# EAGLE design energy-wristband-v1 (EAGLE 5.12)
DATABASE: ../../partsdb.txt; PARTNO: MCP73831T-2ATI/OT
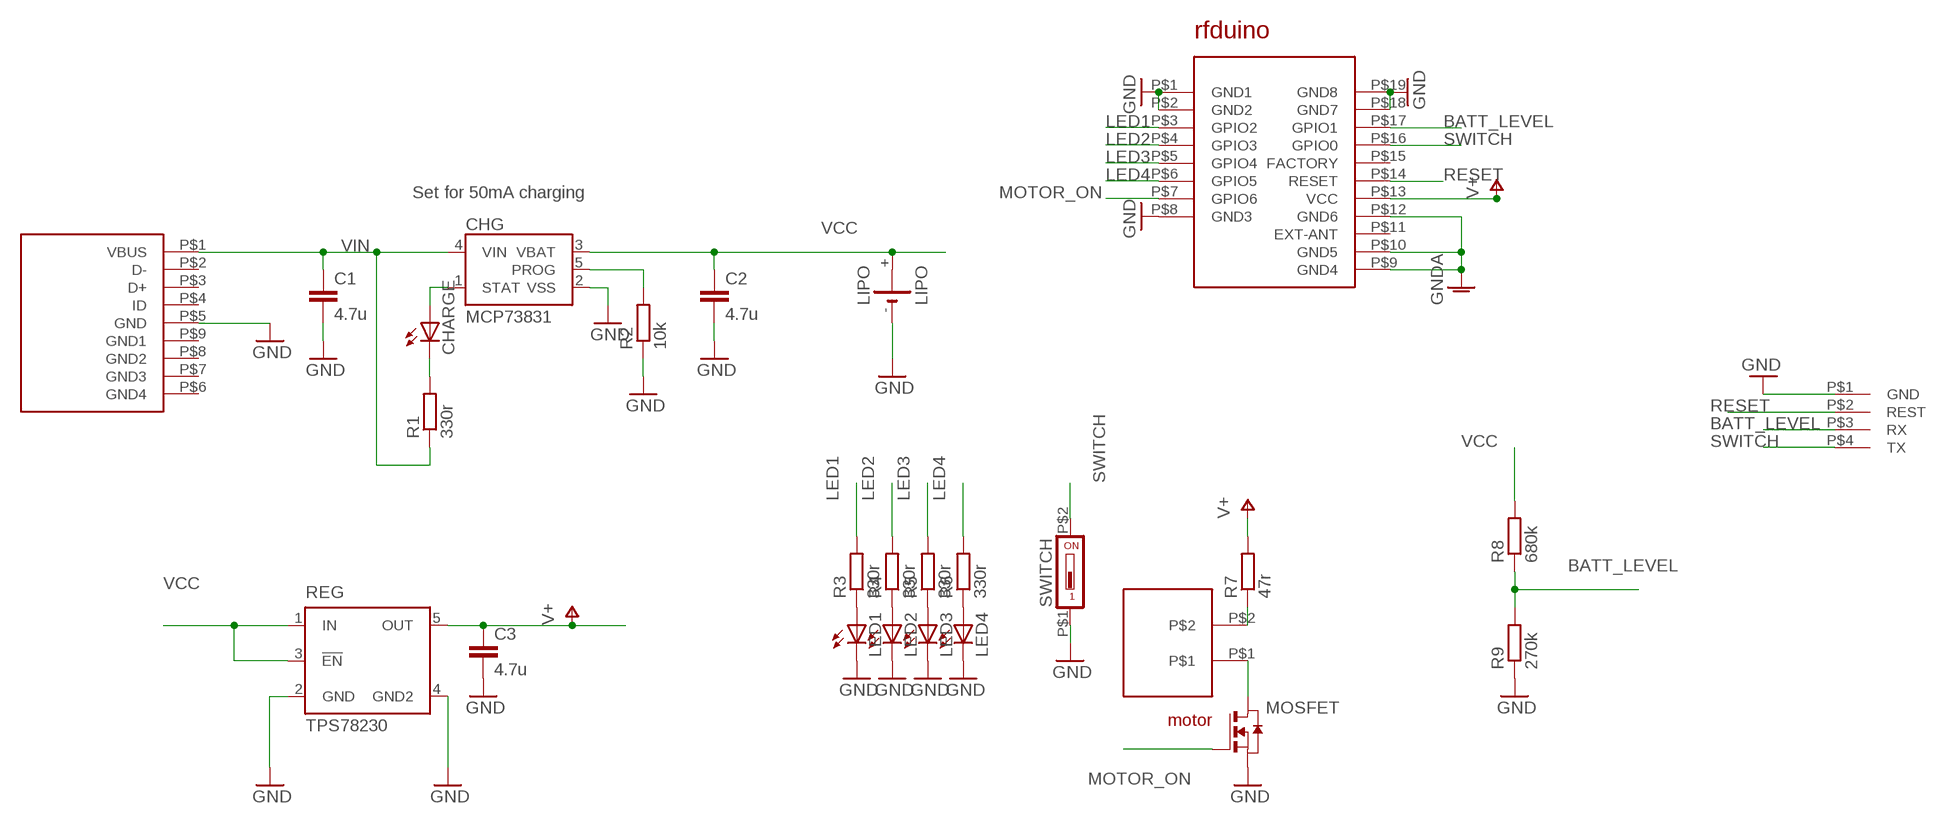
[diagram p0: schematic, sheet 1]

## Parts
C1  4.7u  C-EUC1206  [C1206]
C2  4.7u  C-EUC1206  [C1206]
C3  4.7u  C-EUC1206  [C1206]
CHARGE  LEDSMT1206  [1206]
CHG  MCP73831  [SOT23-5]
LED1  LEDSMT1206  [1206]
LED2  LEDSMT1206  [1206]
LED3  LEDSMT1206  [1206]
LED4  LEDSMT1206  [1206]
LIPO  LIPO  [LIPO]
M1  PAGERMOTOR  [PAGERMOTOR]
MOSFET  NMOSSOT23  [SOT-23]
PRG  PROG-MINI  [PROG-MINI]
R1  330r  R-EU_R1206  [R1206]
R2  10k  R-EU_R1206  [R1206]
R3  330r  R-EU_R1206  [R1206]
R4  330r  R-EU_R1206  [R1206]
R5  330r  R-EU_R1206  [R1206]
R6  330r  R-EU_R1206  [R1206]
R7  47r  R-EU_R1206  [R1206]
R8  680k  R-EU_R1206  [R1206]
R9  270k  R-EU_R1206  [R1206]
REG  TPS78230  [SOT23-DBV]
RFDUINO  RFDUINO  [RFDUINO]
SWITCH  EVPAW  [SD4-01]
USB  USB-MICRO  [USB-MICRO]

## Nets
BATT_LEVEL: PRG.P$3(RX) R8.1 R9.2 RFDUINO.P$17(GPIO1)
GND: C1.2 C2.2 C3.2 CHG.2(VSS) LED1.C LED2.C LED3.C LED4.C LIPO.- MOSFET.2(S) PRG.P$1(GND) R2.1 R9.1 REG.2(GND) REG.4(GND2) RFDUINO.P$1(GND1) RFDUINO.P$2(GND2) RFDUINO.P$8(GND3) RFDUINO.P$18(GND7) RFDUINO.P$19(GND8) SWITCH.P$1 USB.P$5(GND)
GNDA: RFDUINO.P$9(GND4) RFDUINO.P$10(GND5) RFDUINO.P$12(GND6)
LED1: R3.2 RFDUINO.P$3(GPIO2)
LED2: R4.2 RFDUINO.P$4(GPIO3)
LED3: R5.2 RFDUINO.P$5(GPIO4)
LED4: R6.2 RFDUINO.P$6(GPIO5)
MOTOR_ON: MOSFET.1(G) RFDUINO.P$7(GPIO6)
N$1: M1.P$2 R7.1
N$2: LED1.A R3.1
N$3: CHARGE.C R1.2
N$4: LED3.A R5.1
N$5: LED4.A R6.1
N$6: LED2.A R4.1
N$7: M1.P$1 MOSFET.3(D)
PROG: CHG.5(PROG) R2.2
RESET: PRG.P$2(REST) RFDUINO.P$14(RESET)
STAT: CHARGE.A CHG.1(STAT)
SWITCH: PRG.P$4(TX) RFDUINO.P$16(GPIO0) SWITCH.P$2
V+: C3.1 R7.2 REG.5(OUT) RFDUINO.P$13(VCC)
VCC: C2.1 CHG.3(VBAT) LIPO.+ R8.2 REG.1(IN) REG.3(!EN)
VIN: C1.1 CHG.4(VIN) R1.1 USB.P$1(VBUS)
Unconnected: RFDUINO.P$11(EXT-ANT) RFDUINO.P$15(FACTORY) USB.P$2(D-) USB.P$3(D+) USB.P$4(ID) USB.P$6(GND4) USB.P$7(GND3) USB.P$8(GND2) USB.P$9(GND1)

## Notes on the sheet
- Set for 50mA charging

## Library data of the parts
C1-C3 = rcl:C-EU: CAPACITOR, European symbol
CHARGE LED1-LED4 = matt led:LED: LED OSRAM: - CHIPLED LG R971, LG N971, LY N971, LG Q971, LY Q971, LO R971, LY R971 LH N974, LH R974 LS Q976, LO Q976, LY Q976 LO Q996 - Hyper CHIPLED LW Q18S LB Q993, LB Q99A, LB R99A - SideLED LS A670, LO A670, LY A670, LG A670, LP A670 LB A673, LV A673, LT A673, LW A673 LH A674 LY A675 LS A676, LA A676, LO A676, LY A676, LW A676 LS A679, LY A679, LG A679 - Hyper Micro SIDELED® LS Y876, LA Y876, LO Y876, LY Y876 LT Y87S - SmartLED LW L88C, LW L88S LB L89C, LB L89S, LG L890 LS L89K, LO L89K, LY L89K LS L896, LA L896, LO L896, LY L896 - TOPLED LS T670, LO T670, LY T670, LG T670, LP T670 LSG T670, LSP T670, LSY T670, LOP T670, LYG T670 LG T671, LOG T671, LSG T671 LB T673, LV T673, LT T673, LW T673 LH T674 LS T676, LA T676, LO T676, LY T676, LB T676, LH T676, LSB T676, LW T676 LB T67C, LV T67C, LT T67C, LS T67K, LO T67K, LY T67K, LW E67C LS E67B, LA E67B, LO E67B, LY E67B, LB E67C, LV E67C, LT E67C LW T67C LS T679, LY T679, LG T679 LS T770, LO T770, LY T770, LG T770, LP T770 LB T773, LV T773, LT T773, LW T773 LH T774 LS E675, LA E675, LY E675, LS T675 LS T776, LA T776, LO T776, LY T776, LB T776 LHGB T686 LT T68C, LB T68C - Hyper Mini TOPLED® LB M676 - Mini TOPLED Santana® LG M470 LS M47K, LO M47K, LY M47K Source: http://www.osram.convergy.de LUXEON: - LUMILED® LXK2-PW12-R00, LXK2-PW12-S00, LXK2-PW14-U00, LXK2-PW14-V00 LXK2-PM12-R00, LXK2-PM12-S00, LXK2-PM14-U00 LXK2-PE12-Q00, LXK2-PE12-R00, LXK2-PE12-S00, LXK2-PE14-T00, LXK2-PE14-U00 LXK2-PB12-K00, LXK2-PB12-L00, LXK2-PB12-M00, LXK2-PB14-N00, LXK2-PB14-P00, LXK2-PB14-Q00 LXK2-PR12-L00, LXK2-PR12-M00, LXK2-PR14-Q00, LXK2-PR14-R00 LXK2-PD12-Q00, LXK2-PD12-R00, LXK2-PD12-S00 LXK2-PH12-R00, LXK2-PH12-S00 LXK2-PL12-P00, LXK2-PL12-Q00, LXK2-PL12-R00 Source: www.luxeon.com KINGBRIGHT: KA-3528ASYC Source: www.kingbright.com
CHG = SparkFun:MCP73831: Microchip's MCP73831 Miniature single cell, fully integrated Li-Ion, Li-polymer charge management controller http://ww1.microchip.com/downloads/en/DeviceDoc/21984a.pdf
LIPO = matt:LIPO: LI BATTERY Sonnenschein
M1 = matt:PAGERMOTOR
MOSFET = matt:NMOSSOT23: MOS FET; OC_FARNELL: unknown; OC_NEWARK: unknown
PRG = matt:PROG-MINI
R1-R9 = rcl:R-EU_: RESISTOR, European symbol
REG = matt:TPS782*: ULTRALOW-POWER 50-mA LOW-DROPOUT LINEAR REGULATORS 50-mA Low-Dropout Regulator Source: http://focus.ti.com/lit/ds/symlink/tps77001.pdf; MF: TEXAS INSTRUMENTS; MPN: TPS77030DBVT; OC_FARNELL: 1207348; OC_NEWARK: 77C1185
RFDUINO = matt:RFDUINO
SWITCH = matt:EVPAW: DIL/CODE SWITCH; OC_FARNELL: unknown; OC_NEWARK: unknown
USB = matt:USB-MICRO

## Net classes
1 power: width 3 mm

## Board
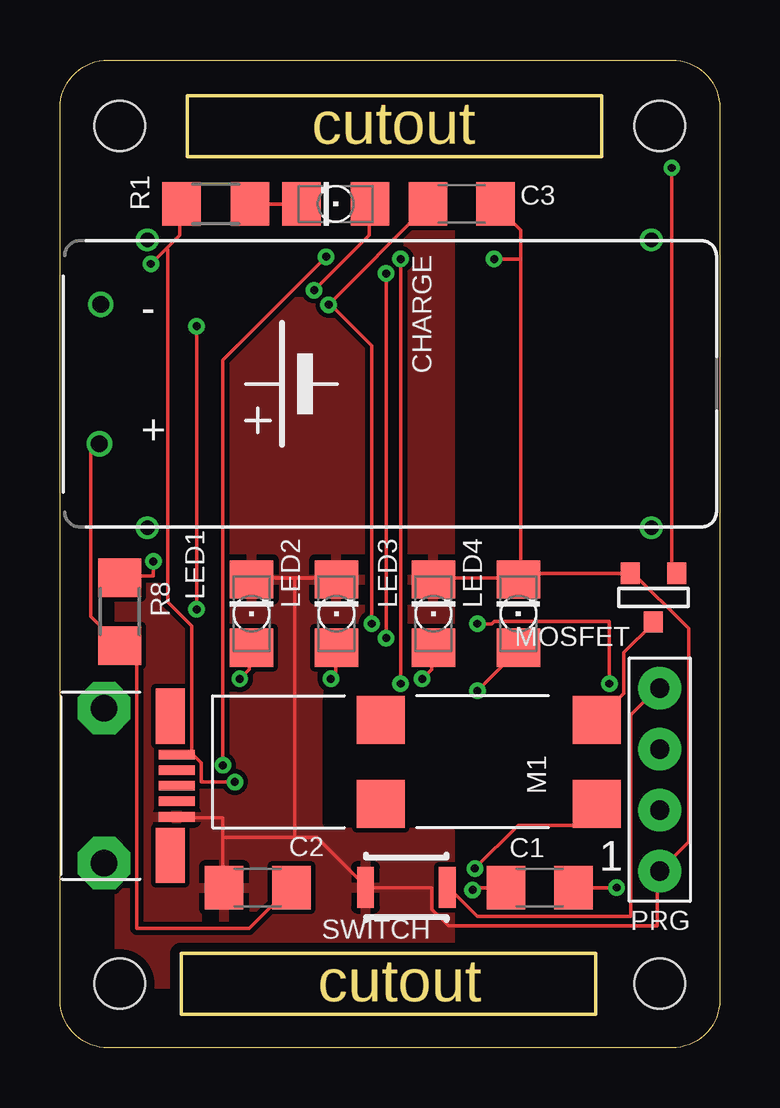
[diagram p1: board, top side]
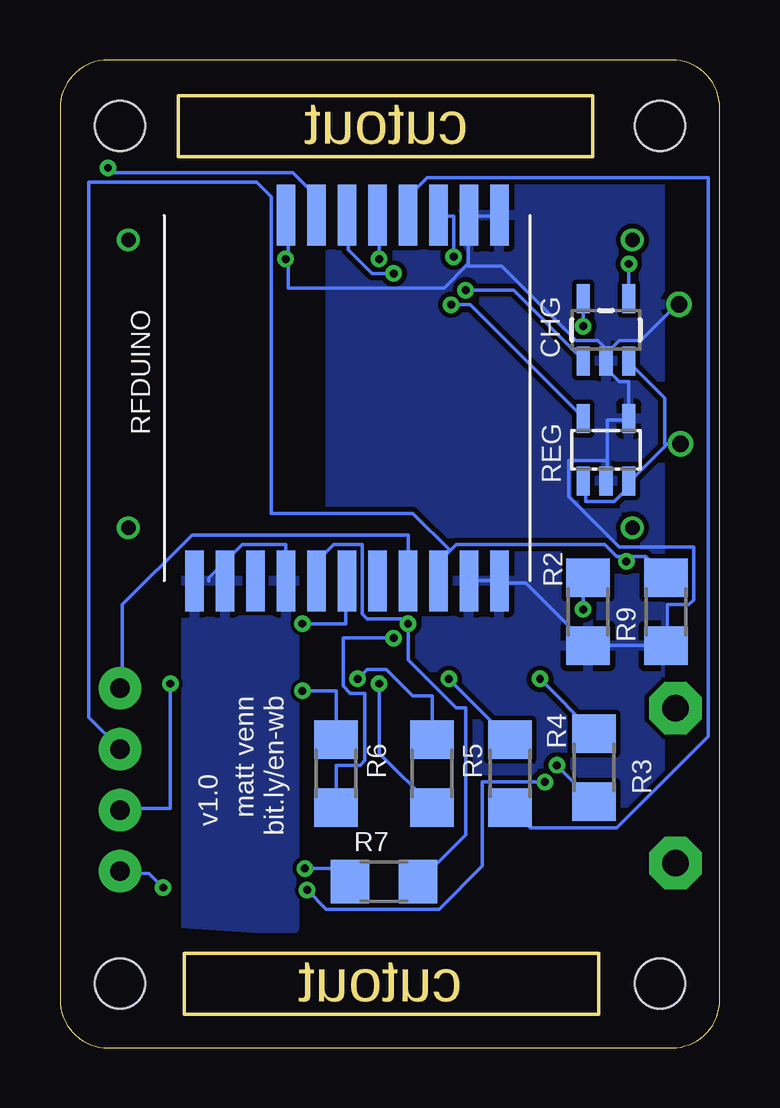
[diagram p2: board, bottom side, seen from below]

Size 27.49 x 41.18 mm. Coordinates in mm from the lower left corner, seen from the top.
Outline: 2,0 arc-90 0,2 0,39.18 arc-90 2,41.18 25.49,41.18 arc-90 27.49,39.18 27.49,2 arc-90 25.49,0 2,0
Outline: 5.05,1.4 5.05,3.94 22.32,3.94 22.32,1.4 5.05,1.4
Outline: 5.3,37.15 5.3,39.69 22.57,39.69 22.57,37.15 5.3,37.15
Copper layers (1*16): Top 0.0356mm / dielectric 1.5011mm / Bottom 0.0356mm
Design rules "LaenPCBOrder": minimum track width 6mil, minimum drill 13mil, track to track 6mil, track to pad 6mil, pad to pad 6mil, via to via 6mil, smd to smd 6mil, copper to edge 15mil, drill to drill 6mil, minimum pad ring 7mil, minimum via ring 7mil, stop-mask expansion 3mil, vias tented up to drill 0mil, thermal gap 10mil
Holes 2.1 mm at 2.49,38.43 24.99,38.43 2.49,2.68 24.99,2.68
bRestrict: area 18.5,4.7 to 22.2,4.9

### Footprints (pad centres in the part's own frame; a part is rotated, then mirrored left to right if it is on the bottom)
C1206 = smd 1.6 x 1.8: 1 -1.4,0; 2 1.4,0
1206 = smd 1.6 x 1.803: A -1.422,0; C 1.422,0
SOT23-5 = smd 0.55 x 1.2: 1 -0.95,-1.3; 2 0,-1.3; 3 0.95,-1.3; 4 0.95,1.3; 5 -0.95,1.3
LIPO = drill 0.7 round: + -11.5,-2.5; - -11.445,3.31 | drill 0.6 round: P$1 -9.5,6; P$2 -9.5,-6; P$3 11.5,-6; P$4 11.5,6
PAGERMOTOR = smd 2 x 2: P$1 -7.62,-2; P$2 -7.62,1.5; P$3 1.38,1.5; P$4 1.38,-2
SOT-23 = smd 0.787 x 0.889: 1 -0.991,-1.016; 2 0.94,-1.016; 3 -0.025,1.016
PROG-MINI = drill 0.8 pad 1.778 round: P$1 0,-3.81; P$2 0,-1.27; P$3 0,1.27; P$4 0,3.81
R1206 = smd 1.6 x 1.803: 1 -1.422,0; 2 1.422,0
SOT23-DBV = smd 0.55 x 1.2: 1 -0.95,-1.3; 2 0,-1.3; 3 0.95,-1.3; 4 0.95,1.3; 5 -0.95,1.3
RFDUINO = smd 2.54 x 0.762: P$1 -7.62,6.35; P$2 -7.62,5.08; P$3 -7.62,3.81; P$4 -7.62,2.54; P$5 -7.62,1.27; P$6 -7.62,0; P$7 -7.62,-1.27; P$8 -7.62,-2.54; P$9 7.62,-6.35; P$10 7.62,-5.08; P$11 7.62,-3.81; P$12 7.62,-2.54; P$13 7.62,-1.27; P$14 7.62,0; P$15 7.62,1.27; P$16 7.62,2.54; P$17 7.62,3.81; P$18 7.62,5.08; P$19 7.62,6.35
SD4-01 = smd 1.7 x 0.7: P$1 0,-1.8; P$2 0,1.6
USB-MICRO = smd 0.4 x 1.5: P$1 -1.3,4.125; P$2 -0.65,4.125; P$3 0,4.125; P$4 0.65,4.125; P$5 1.3,4.125 | smd 2.3 x 1.2: P$6 2.9,3.85; P$7 -2.9,3.85 | drill 1.1 pad 2.184 octagon: P$8 3.225,1.1; P$9 -3.225,1.1

### Placement (x,y rotation side)
C1  19.99,6.68 0 top
C2  8.24,6.68 180 top
C3  16.74,35.18 0 top
CHARGE  11.49,35.18 180 top
CHG  4.74,29.93 0 bottom
LED1  7.98,18.1 90 top
LED2  11.52,18.1 90 top
LED3  15.56,18.1 90 top
LED4  19.1,18.1 90 top
LIPO  13.14,27.68 0 top
M1  14.74,11.68 180 top
MOSFET  24.7,18.77 180 top
PRG  24.99,11.18 0 top
R1  6.49,35.18 0 top
R2  5.49,18.18 90 bottom
R3  5.24,11.68 270 bottom
R4  8.74,11.43 270 bottom
R5  11.99,11.43 270 bottom
R6  15.99,11.43 270 bottom
R7  13.99,6.93 0 bottom
R8  2.49,18.18 270 top
R9  2.24,18.18 90 bottom
REG  4.74,24.93 0 bottom
RFDUINO  15.53,27.09 270 bottom
SWITCH  14.53,6.69 270 top
U$2  [OPENHWLOGOSMALL]  16.63,23.07 0 top
USB  0.74,10.93 270 top

### Tracks (layer width: path | path; a pad name or v marks a point on that pad's centre or on a via)
BATT_LEVEL  (via drill 0.33)
  Top 0.152: v3.89,20.28 3.89,19.68 2.49,19.68 R8.1
  Bottom 0.152: 3.89,20.48 4.29,20.48 4.79,20.98 10.99,20.98 11.24,20.73 | 3.89,20.48 3.09,20.48 2.29,19.68 R9.2 | 11.24,20.73 11.69,20.28 11.69,19.48 RFDUINO.P$17 | 3.89,20.48 v3.89,20.28 | PRG.P$3 24.99,12.48 26.29,13.78 26.29,36.08 19.29,36.08 18.69,35.48 18.69,22.28 12.79,22.28 11.24,20.73
GND  (via drill 0.33)
  Top 0.152: 9.79,19.58 11.49,19.58 LED2.C | 9.79,19.58 7.99,19.58 LED1.C | 6.79,8.78 6.79,6.68 C2.2 | 6.79,8.78 6.79,9.58 4.89,9.58 USB.P$5 | 6.79,8.78 9.79,8.78 | 9.79,8.78 10.69,8.78 12.69,6.78 SWITCH.P$1 12.79,6.68 15.49,6.68 15.49,5.78 16.19,5.08 24.89,5.08 24.89,7.28 PRG.P$1 26.19,8.58 26.19,17.48 23.79,19.88 MOSFET.2 23.69,19.78 19.19,19.78 | 9.79,8.78 9.79,19.58 | v23.19,6.68 C1.2 | 19.19,19.78 19.19,19.58 LED4.C | 19.19,19.78 19.19,32.88 | 19.19,32.88 19.19,34.08 18.19,35.08 C3.2 | 19.19,19.78 LED4.C | LED3.C 15.59,19.58 19.09,19.58 LED4.C | 19.19,32.88 v18.09,32.88
  Bottom 0.152: 5.49,16.78 2.29,16.78 R9.1 2.19,16.78 2.19,18.48 1.29,18.48 1.09,18.68 1.09,20.88 4.19,20.88 6.29,22.98 6.29,24.48 4.69,24.48 | RFDUINO.P$18 10.39,19.48 RFDUINO.P$19 9.09,19.38 8.09,19.38 5.49,16.78 | 5.49,16.78 R2.1 | CHG.2 4.69,28.58 4.69,28.28 4.19,27.78 3.79,27.78 3.79,26.28 REG.4 3.79,26.18 4.69,26.18 4.69,24.48 | 4.69,24.48 4.69,23.68 REG.2 | LIPO.- 1.79,30.98 3.29,29.48 4.19,29.48 4.69,28.98 4.69,28.68 CHG.2 | RFDUINO.P$1 9.19,34.68 10.39,34.68 RFDUINO.P$2 10.49,34.68 10.49,32.68 10.54,32.63 | 17.99,32.88 17.99,31.68 11.49,31.68 10.54,32.63 | 17.99,32.88 17.99,34.68 RFDUINO.P$8 | CHG.2 4.69,29.08 5.09,29.48 5.99,29.48 9.09,32.58 10.49,32.58 10.54,32.63 | v23.19,6.68 23.79,7.28 24.89,7.28 PRG.P$1 | v18.09,32.88 17.99,32.88
  pour Bottom (isolate 0.2): 2.49,38.18 16.24,38.18 16.24,2.43 2.49,2.43 2.49,37.43
  pour Top (isolate 0.2): 2.49,38.43 16.24,38.43 16.24,2.68 2.49,2.68
GNDA
  Bottom 0.152: RFDUINO.P$12 18.09,19.48 18.09,20.98 19.89,20.98 21.29,19.58 21.29,19.47
  pour Bottom: 17.74,19.78 17.74,4.98 22.24,4.98 22.24,19.78
LED1  (via drill 0.33)
  Top 0.152: v6.79,11.78 6.79,28.68 v11.09,32.98
  Bottom 0.152: v6.79,11.78 5.29,10.28 R3.2 | v11.09,32.98 11.09,34.68 11.69,34.68 RFDUINO.P$3
LED2
  Bottom 0.152: R4.2 8.69,9.98 7.89,9.18 4.29,9.18 0.49,12.98 0.49,36.28 12.19,36.28 12.99,35.48 RFDUINO.P$4
LED3  (via drill 0.33)
  Top 0.152: v14.19,15.18 v14.19,32.88
  Bottom 0.152: v14.19,15.18 14.19,12.28 11.99,10.08 R5.2 | v14.19,32.88 14.19,34.68 RFDUINO.P$5
LED4  (via drill 0.33)
  Top 0.152: v13.59,17.08 v13.59,32.28
  Bottom 0.152: v13.59,17.08 15.69,17.08 15.69,15.08 15.39,14.78 14.79,14.78 14.79,11.98 14.99,11.78 15.99,11.78 R6.2 | v13.59,32.28 14.49,32.28 15.49,33.28 15.49,34.68 RFDUINO.P$6
MOTOR_ON  (via drill 0.33)
  Top 0.152: v25.49,36.68 25.49,20.08 25.69,19.88 MOSFET.1
  Bottom 0.152: v25.49,36.68 25.29,36.48 17.79,36.48 16.89,35.58 16.89,34.78 RFDUINO.P$7
N$1  (via drill 0.33)
  Top 0.152: v17.29,7.48 19.09,9.28 22.29,9.28 22.29,10.18 M1.P$2
  Bottom 0.152: v17.29,7.48 15.99,7.48 15.49,6.98 R7.1
N$2  (via drill 0.33)
  Top 0.152: v7.49,15.38 7.89,15.78 7.89,16.58 LED1.A
  Bottom 0.152: v7.49,15.38 5.29,13.18 R3.1
N$3
  Top 0.152: R1.2 7.99,35.18 9.99,35.18 CHARGE.C
N$4  (via drill 0.33)
  Top 0.152: v15.09,15.38 15.49,15.78 15.49,16.58 LED3.A
  Bottom 0.152: v15.09,15.38 14.69,15.78 13.89,15.78 12.79,14.68 11.99,14.68 R5.1
N$5  (via drill 0.33)
  Top 0.152: v17.39,14.88 19.09,16.58 LED4.A
  Bottom 0.152: v17.39,14.88 15.99,14.88 R6.1
N$6  (via drill 0.33)
  Top 0.152: v11.29,15.38 11.49,15.58 11.49,16.58 LED2.A
  Bottom 0.152: v11.29,15.38 8.79,12.88 R4.1
N$7
  Top 0.152: MOSFET.3 24.69,17.68 23.49,16.48 23.49,14.78 22.39,13.68 M1.P$1
PROG  (via drill 0.33)
  Top 0.152: v5.69,18.28 v5.69,30.08
  Bottom 0.152: v5.69,18.28 5.69,19.58 5.49,19.58 R2.2 | v5.69,30.08 CHG.5
RESET  (via drill 0.33)
  Top 0.152: v17.39,17.68 17.99,17.68 18.09,17.78 22.89,17.78 v22.89,15.18
  Bottom 0.152: v17.39,17.68 15.59,17.68 15.59,19.38 RFDUINO.P$14 | v22.89,15.18 22.89,9.98 24.89,9.98 PRG.P$2
STAT  (via drill 0.33)
  Top 0.152: v10.59,31.58 12.89,33.88 12.89,35.08 CHARGE.A
  Bottom 0.152: v10.59,31.58 8.59,31.58 5.69,28.68 CHG.1
SWITCH
  Top 0.152: SWITCH.P$2 16.19,6.68 17.39,5.48 23.79,5.48 23.79,13.88 24.89,14.98 PRG.P$4
  Bottom 0.152: RFDUINO.P$16 12.99,21.38 21.99,21.38 24.89,18.48 24.89,15.08 PRG.P$4
V+  (via drill 0.33)
  Top 0.152: C3.1 15.29,35.08 v11.19,30.98 11.29,30.98 12.99,29.28 v12.99,17.68
  Bottom 0.152: v11.19,30.98 10.39,30.98 5.69,26.28 REG.5 | R7.2 12.49,6.98 10.59,8.88 10.59,14.18 10.99,14.18 12.99,16.18 v12.99,17.68 12.99,17.88 14.69,17.88 14.89,18.08 14.89,20.98 16.09,20.98 16.79,20.28 RFDUINO.P$13
VCC
  Top 0.152: C2.1 9.59,6.68 7.89,4.98 3.19,4.98 3.19,15.98 2.49,16.68 R8.2 2.49,16.78 1.29,17.98 1.29,24.88 1.59,25.18 LIPO.+
  Bottom 0.152: 2.24,25.13 2.19,25.18 LIPO.+ | 2.24,25.13 3.69,23.68 REG.3 3.79,23.58 3.79,23.38 4.39,22.78 5.59,22.78 5.59,23.58 REG.1 | CHG.3 3.79,28.58 2.29,27.08 2.29,25.18 2.24,25.13
VIN  (via drill 0.33)
  Top 0.152: 4.44,33.33 4.99,33.88 4.99,35.08 R1.1 | 4.44,33.33 v3.79,32.68 | 5.49,12.28 4.89,12.28 USB.P$1 5.49,12.28 | 5.49,12.28 5.49,17.58 4.49,18.58 4.49,33.28 4.44,33.33 | C1.1 17.19,6.68 v17.19,6.58 | v7.29,11.08 5.89,11.08 5.89,11.88 5.49,12.28
  Bottom 0.152: v3.79,32.68 CHG.4 | v17.19,6.58 16.39,5.78 11.69,5.78 9.89,7.58 9.89,11.08 v7.29,11.08

### Text on the board
Dimension: cutout | cutout
bNames: bit.ly/en-wb | matt venn | v1.0